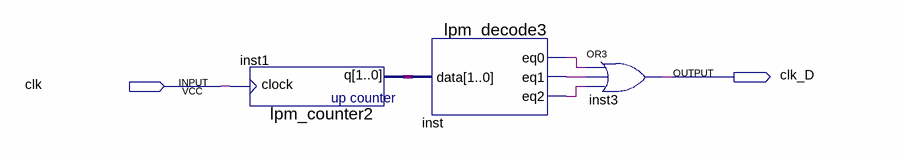
[diagram p0: schematic sheet]
// Quartus schematic Devider_LOCAL_1114.bdf as structural Verilog: 3 symbols, 2 pins
module Devider_LOCAL_1114 (
  input  clk,
  output clk_D
);

  wire inst_eq0, inst_eq1, inst_eq2;
  wire [1:0] inst1_q;

  lpm_counter2 inst1 (.clock(clk), .q(inst1_q));
  lpm_decode3 inst (.data(inst1_q), .eq0(inst_eq0), .eq1(inst_eq1), .eq2(inst_eq2));
  or inst3 (clk_D, inst_eq0, inst_eq1, inst_eq2);
endmodule
